# Altium schematic sheet socket_power_supply.SchDoc: APTOMAT - Power Supply
size A4; Revision: 1.1.1; SheetNumber: 5; SheetTotal: 5; DrawnBy: KJP; ProjectNumber: 4397; PCBRevision: 0071KJP; DocumentSize: A4; PCAName: PCA10040; PCBNumber: 400150; ProjectName: Quark
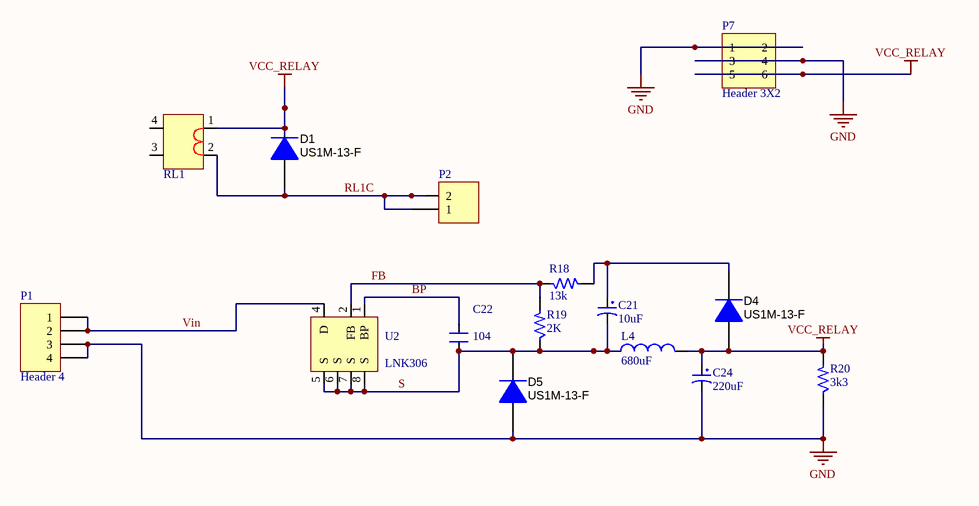
[diagram p0: socket_power_supply.SchDoc]

## Parts
C21  10uF  [TU_NHOM_10uF_MH]
C22  104  [0805_HV]
C24  220uF  [TU_NHOM_2.5_MH]
D1  US1M-13-F  [SMB]
D4  US1M-13-F  [SMB]
D5  US1M-13-F  [SMB]
L4  680uF  [Inductor 4.5x5]
P1  Header 4  [HDR1X4]
P2  Header 2  [HDR1X2]  (value not drawn)
P7  Header 3X2  [HDR2X3]
R18  13k  [0805_HV]
R19  2K  [0805_HV]
R20  3k3  [0805_HV]
RL1  Component_1  [RELAY25AOMRON]  (value not drawn)
U2  LNK306  [SOP 7]

## Nets
GND: C24.2 D5.2(A) P1.3 P1.4 P7.1 P7.2 P7.3 P7.4 R20.1
VCC_RELAY: C24.1 D1.1(K) D4.2(A) L4.2 P7.5 P7.6 R20.2 RL1.1
BP: C22.2 U2.1(BP)
FB: R18.1 R19.2 U2.2(FB)
RL1C: D1.2(A) P2.1 P2.2 RL1.2
S: C21.2 C22.1 D5.1(K) L4.1 R19.1 U2.5(S) U2.6(S) U2.7(S) U2.8(S)
Vin: P1.1 P1.2 U2.4(D)
NetC21_1: C21.1 D4.1(K) R18.2

Not connected (* = marked no-connect by the designer): RL1 3 4

## Notes on the sheet
- Title
- Size:
- Date:
- A4
- Number:
- Time:
- Revision:
- Sheet
- of
- File:

## Library data of the parts
C21 = TU_NHOM_10uF_25V_MH: Value: 47uF/16 - 50V; Description 1: 470uF/6,3V - 330uF/10V - 220uF/16V; Description 2: 100uF/25V - 35V - 47uF/50V - 22uF/100V; Description 3: 33uF => 47uF/63V - 1uF => 4,7uF/160V; Description 4: 1uF => 2,2uF/250V - 1uF/350V
C22 = CM: Cap SMD; Value: 103
C24 = TU_NHOM_220uF_25V_MH: LINK: https://item.taobao.com/item.htm?spm=a230r.1.14.282.6c612953FsebRk&id=546158429968&ns=1&abbucket=10#detail
D1 D4 D5 = MURS160-13-F: Diode, Ultrafast, 600V, 1A, SMB; Manufacturer: Diodes Inc.; U/M: EA; Vf_V: 1.25; Value2: 1.25V; Io_A: 1; Vr_V: 600; TJmax_C: 150; RJC_CperW: 13; PartNumber: US1M-13-F; CompType: Diode; SymbolVersion: 2008-12-08; MountType: SMT; RoHS: Y; Value: 600V; PackageReference: SMB; Value1: 1A; Type: Ultrafast; Published: 2008-06-26; Publisher: Texas Instruments; LatestRevisionDate: 2013-06-21; ComponentLink1Description: Datasheet link; ComponentLink1URL: http://www.diodes.com/datasheets/ds30130.pdf; Supplier 1: Digi-Key; Supplier 2: Mouser; Supplier 3: Farnell
L4 = Inductor 4.5x5_MH
P1 = Header 4: Header, 4-Pin; LatestRevisionDate: 17-Jul-2002; LatestRevisionNote: Re-released for DXP Platform.; Publisher: Altium Limited
P2 = Header 2: Header, 2-Pin; LatestRevisionDate: 17-Jul-2002; LatestRevisionNote: Re-released for DXP Platform.; Publisher: Altium Limited
P7 = Header 3X2: Header, 3-Pin, Dual row; LatestRevisionDate: 17-Jul-2002; LatestRevisionNote: Re-released for DXP Platform.; Publisher: Altium Limited
R18-R20 = R: Resistor 1/4W; Value: R1/4W - 1K
U2 = Component_1